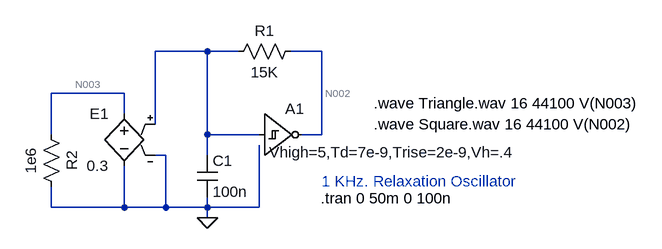
[diagram p0: schematic RelaxOsc.asc]
RelaxOsc.asc, the LTspice schematic file:
Version 4
SHEET 1 880 680
WIRE 64 304 64 320
WIRE 64 240 64 208
WIRE 64 80 112 80
WIRE 144 320 64 320
WIRE 64 320 64 336
WIRE 240 208 240 80
WIRE 240 80 192 80
WIRE 208 208 240 208
WIRE 144 224 144 320
WIRE 144 208 64 208
WIRE 64 208 64 80
WIRE -16 240 0 240
WIRE 0 240 0 320
WIRE 0 320 64 320
WIRE -16 192 -16 80
WIRE -16 80 64 80
WIRE -64 256 -64 320
WIRE -64 320 0 320
WIRE -176 288 -176 320
WIRE -176 320 -64 320
WIRE -176 208 -176 144
WIRE -176 144 -64 144
WIRE -64 144 -64 176
FLAG 64 336 0
SYMBOL res 208 64 R90
WINDOW 0 0 56 VBottom 0
WINDOW 3 32 56 VTop 0
SYMATTR InstName R1
SYMATTR Value 15K
SYMATTR SpiceLine tol=1 pwr=0.1
SYMBOL cap 48 240 R0
SYMATTR InstName C1
SYMATTR Value 100n
SYMBOL Digital\\schmtinv 144 144 R0
WINDOW 3 15 91 Left 0
SYMATTR Value Vhigh=5,Td=7e-9,Trise=2e-9,Vh=.4
SYMATTR InstName A1
SYMBOL e -64 160 M0
SYMATTR InstName E1
SYMATTR Value 0.3
SYMBOL res -160 304 R180
WINDOW 0 0 56 VBottom 0
WINDOW 3 32 56 VTop 0
SYMATTR InstName R2
SYMATTR Value 1e6
SYMATTR SpiceLine tol=1 pwr=0.1
TEXT 238 306 Left 0 !.tran 0 50m 0 100n
TEXT 240 280 Left 0 ;1 KHz. Relaxation Oscillator
TEXT 320 160 Left 0 !.wave Triangle.wav 16 44100 V(N003)
TEXT 320 192 Left 0 !.wave Square.wav 16 44100 V(N002)

The netlist it stands for:
* RelaxOsc.asc
R1 N002 N001 15K tol=1 pwr=0.1
C1 N001 0 100n
A1 N001 0 0 0 0 N002 0 0 SCHMITT Vhigh=5,Td=7e-9,Trise=2e-9,Vh=.4
E1 N003 0 N001 0 0.3
R2 0 N003 1e6 tol=1 pwr=0.1
.tran 0 50m 0 100n
* 1 KHz. Relaxation Oscillator
.wave Triangle.wav 16 44100 V(N003)
.wave Square.wav 16 44100 V(N002)
.backanno
.end